# EAGLE design tinyx_core_v0 (EAGLE 9.4.2)
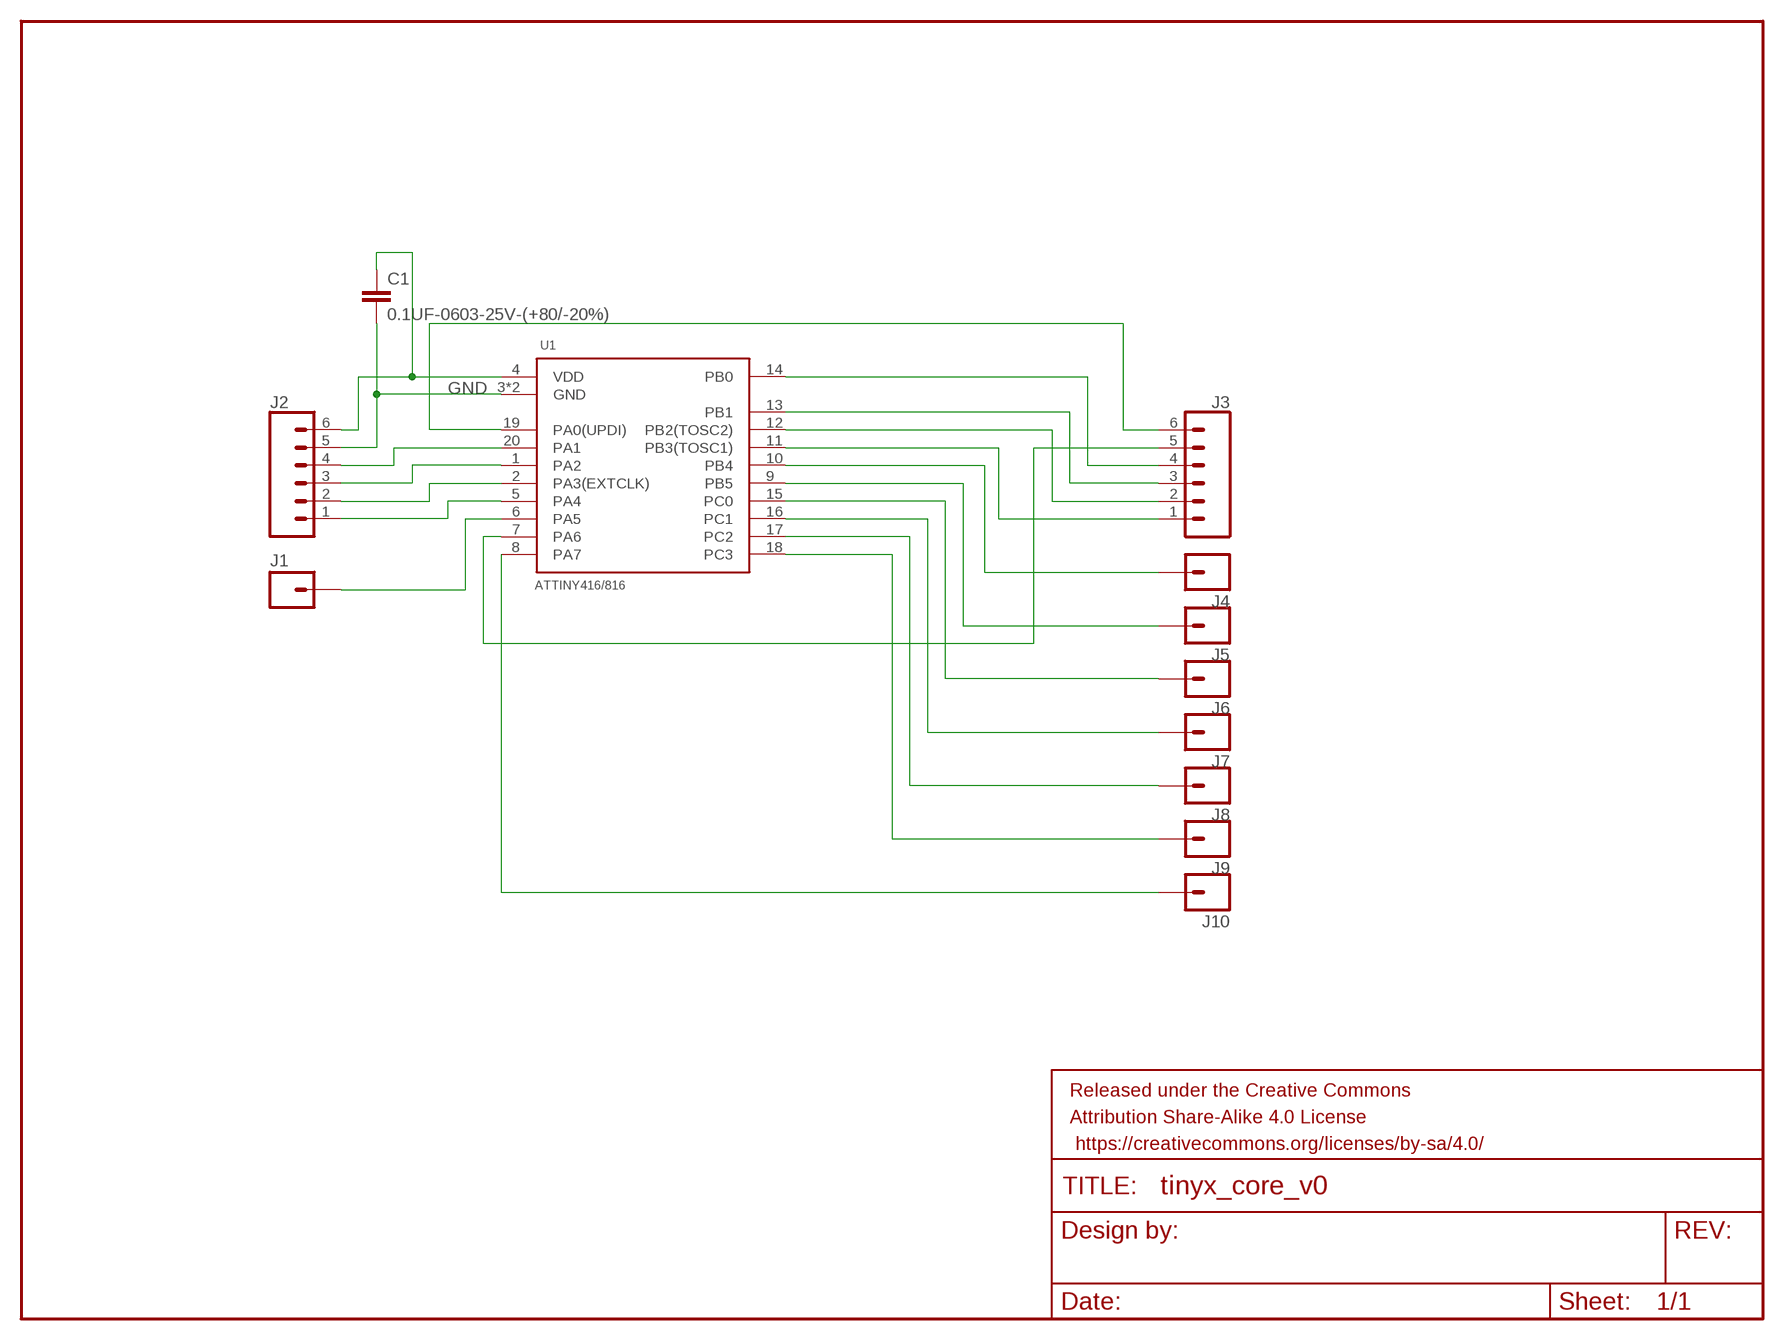
[diagram p0: schematic, sheet 1]

## Parts
C1  0.1UF-0603-25V-(+80/-20%)  [0603]
FRAME1  FRAME-LETTER  [CREATIVE_COMMONS]
J1  M01TINY  [1X01_TINY]
J2  CONN_06NO_SILK_FEMALE_PTH  [1X06_NO_SILK]
J3  CONN_06NO_SILK_FEMALE_PTH  [1X06_NO_SILK]
J4  M01TINY  [1X01_TINY]
J5  M01TINY  [1X01_TINY]
J6  M01TINY  [1X01_TINY]
J7  M01TINY  [1X01_TINY]
J8  M01TINY  [1X01_TINY]
J9  M01TINY  [1X01_TINY]
J10  M01TINY  [1X01_TINY]
U1  ATTINY416/816  [VQFN-20]

## Nets
GND: C1.2 J2.5 U1.3(GND) U1.EXP(GND)
N$1: C1.1 J2.6 U1.4(VDD)
N$3: J2.4 U1.20(PA1)
N$4: J2.3 U1.1(PA2)
N$5: J2.2 U1.2(PA3(EXTCLK))
N$6: J2.1 U1.5(PA4)
N$7: J3.6 U1.19(PA0(UPDI))
N$8: J3.5 U1.7(PA6)
N$9: J3.4 U1.14(PB0)
N$10: J3.3 U1.13(PB1)
N$11: J3.2 U1.12(PB2(TOSC2))
N$12: J3.1 U1.11(PB3(TOSC1))
N$13: J1.P$1 U1.6(PA5)
N$14: J4.P$1 U1.10(PB4)
N$15: J5.P$1 U1.9(PB5)
N$16: J6.P$1 U1.15(PC0)
N$17: J7.P$1 U1.16(PC1)
N$18: J8.P$1 U1.17(PC2)
N$19: J9.P$1 U1.18(PC3)
N$20: J10.P$1 U1.8(PA7)

## Library data of the parts
C1 = SparkFun-Capacitors:0.1UF: 0.1µF ceramic capacitors A capacitor is a passive two-terminal electrical component used to store electrical energy temporarily in an electric field.; PROD_ID: CAP-00810; VALUE: 0.1uF
FRAME1 = SparkFun-Aesthetics:FRAME-LETTER: Schematic Frame - Letter Standard 8.5x11 US Letter frame
J1 J4-J10 = graftel-internal-ic:M01: Header 1 Standard 1-pin 0.1" header. Use with straight break away headers (SKU : PRT-00116), right angle break away headers (PRT-00553), swiss pins (PRT-00743), machine pins (PRT-00117), and female headers (PRT-00115). SMTSO-256-ET is a "flush mount" nut for a 4-40 screw. The older package used to be too tight, and did not allow it to sit properly thru the drill hit. The latest (0.165DIA) fits nice and snug.
J2 J3 = SparkFun-Connectors:CONN_06: Multi connection point. Often used as Generic Header-pin footprint for 0.1 inch spaced/style header connections On any of the 0.1 inch spaced packages, you can populate with these: Break Away Headers - Straight <https://www.sparkfun.com/products/116> (PRT-00116) Break Away Male Headers - Right Angle <https://www.sparkfun.com/products/553> (PRT-00553) Female Headers <https://www.sparkfun.com/products/115> (PRT-00115) Break Away Headers - Machine Pin <https://www.sparkfun.com/products/117> (PRT-00117) Break Away Female Headers - Swiss Machine Pin <https://www.sparkfun.com/products/743> (PRT-00743) Arduino Stackable Header - 6 Pin <https://www.sparkfun.com/products/9280> (PRT-09280) For SCREWTERMINALS and SPRING TERMINALS visit here: Screw Terimnals on SparkFun.com <https://www.sparkfun.com/search/results?term=Screw+Terminals> (5mm/3.5mm/2.54mm spacing) This device is also useful as a general connection point to wire up your design to another part of your project. Our various solder wires solder well into these plated through hole pads. Hook-Up Wire - Assortment (Stranded, 22 AWG) <https://www.sparkfun.com/products/11375> (PRT-11375) Hook-Up Wire - Assortment (Solid Core, 22 AWG) <https://www.sparkfun.com/products/11367> (PRT-11367) View the entire wire category on our website here <https://www.sparkfun.com/categories/141>; PROD_ID: CONN-08437
U1 = graftel-internal-ic:ATTINY416/816

## Board
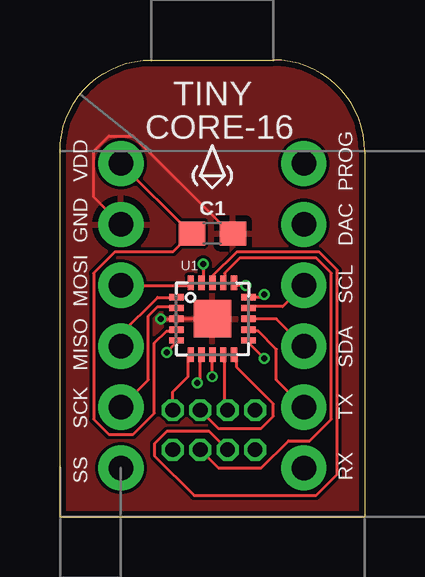
[diagram p1: board, top side]
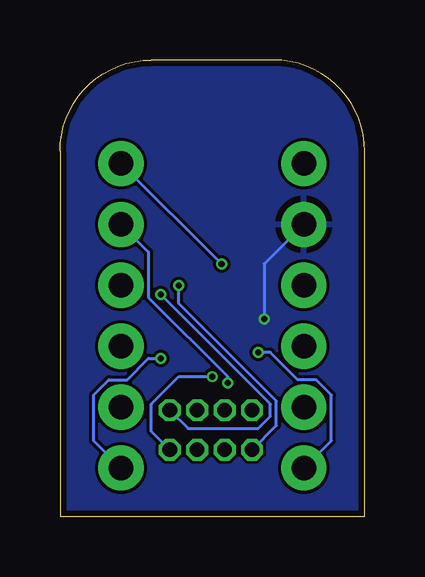
[diagram p2: board, bottom side, seen from below]

Size 12.7 x 19.05 mm. Coordinates in mm from the lower left corner, seen from the top.
Outline: 0,0 12.7,0 12.7,15.24 arc90 8.89,19.05 3.81,19.05 arc90 0,15.24 0,0
Copper layers (1*16): Top 0.035mm / dielectric 1.5mm / Bottom 0.035mm
Design rules "MF_Standard_2_Layer": minimum track width 5mil, minimum drill 10mil, track to track 5mil, track to pad 5mil, pad to pad 5mil, via to via 5mil, smd to smd 0mil, copper to edge 10mil, drill to drill 10mil, minimum pad ring 4mil, minimum via ring 4mil, stop-mask expansion 2mil, vias tented up to drill 25mil, thermal gap 10mil

### Footprints (pad centres in the part's own frame; a part is rotated, then mirrored left to right if it is on the bottom)
0603 = smd 1.1 x 1: 1 -0.85,0; 2 0.85,0
1X01_TINY = drill 0.61 octagon: P$1 0,0
1X06_NO_SILK = drill 1.016 pad 1.88: 1 0,0; 2 2.54,0; 3 5.08,0; 4 7.62,0; 5 10.16,0; 6 12.7,0
VQFN-20 = smd 0.6 x 0.26: 1 -1.5,0.9; 2 -1.5,0.45; 3 -1.5,0; 4 -1.5,-0.45; 5 -1.5,-0.9; 11 1.5,-0.9; 12 1.5,-0.45; 13 1.5,0; 14 1.5,0.45; 15 1.5,0.9 | smd 0.26 x 0.6: 6 -0.9,-1.5; 7 -0.45,-1.5; 8 0,-1.5; 9 0.45,-1.5; 10 0.9,-1.5; 16 0.9,1.5; 17 0.45,1.5; 18 0,1.5; 19 -0.45,1.5; 20 -0.9,1.5 | smd 1.55 x 1.55: EXP 0,0

### Placement (x,y rotation side)
C1  6.35,11.81 0 top
FRAME1  17.78,-16.51 0 top  (outside the outline)
J1  4.7,4.45 0 top
J2  2.54,2.03 90 top
J3  10.16,2.03 90 top
J4  5.84,4.45 0 top
J5  6.99,4.45 0 top
J6  8.13,4.45 0 top
J7  4.7,2.79 0 top
J8  5.84,2.79 0 top
J9  6.99,2.79 0 top
J10  8.13,2.79 90 top
U1  6.35,8.26 0 top

### Tracks (layer width: path | path; a pad name or v marks a point on that pad's centre or on a via)
GND  (via drill 0.25)
  Top 0.127: U1.EXP U1.3 v4.19,8.26 | J2.5 1.4,13.34 1.4,15.24 2.03,15.88 3.05,15.88 7.11,11.81 C1.2
  Bottom 0.127: v4.19,8.26 4.19,10.54 J2.5
  pour Top: 0,0 0,15.24 arc-90 3.81,19.05 8.89,19.05 arc-90 12.7,15.24 12.7,0
  pour Bottom: 0,0 0,15.24 arc-90 3.81,19.05 8.89,19.05 arc-90 12.7,15.24 12.7,0
N$1
  Top 0.127: 5.46,11.81 4.7,11.05 2.29,11.05 1.4,10.16 1.4,4.06 2.03,3.43 3.05,3.43 3.94,4.32 3.94,7.24 4.45,7.75 4.83,7.75 U1.4 | 5.46,11.81 J2.6 | 5.46,11.81 C1.1
N$3
  Top 0.127: J2.4 5.33,9.65 U1.20
N$4
  Top 0.127: J2.3 2.54,7.62 4.06,9.14 4.83,9.14 U1.1
N$5
  Top 0.127: J2.2 3.68,5.71 3.68,8.38 4.06,8.76 4.83,8.76 U1.2
N$6  (via drill 0.25)
  Top 0.127: v4.45,6.86 4.83,7.24 U1.5
  Bottom 0.127: v4.45,6.86 3.94,6.86 2.79,5.71 2.03,5.71 1.4,5.08 1.4,3.17 J2.1
N$7  (via drill 0.25)
  Top 0.127: v5.97,10.54 5.97,9.78 U1.19
  Bottom 0.127: J3.6 v5.97,10.54
N$8  (via drill 0.25)
  Top 0.127: v5.71,5.59 5.84,5.71 5.84,6.73 U1.7
  Bottom 0.127: v5.71,5.59 5.71,5.84 9.02,9.14 9.02,11.05 J3.5
N$9
  Top 0.127: J3.4 9.27,8.76 7.87,8.76 U1.14
N$10
  Top 0.127: U1.13 9.02,8.26 J3.3
N$11
  Top 0.127: J3.2 9.02,5.71 9.02,6.99 8.26,7.75 7.87,7.75 U1.12
N$12  (via drill 0.25)
  Top 0.127: v8.51,6.6 7.87,7.24 U1.11
  Bottom 0.127: v8.51,6.6 9.02,6.6 9.91,5.71 10.67,5.71 11.3,5.08 11.3,3.17 J3.1
N$13
  Top 0.127: J1.P$1 4.7,5.21 5.33,5.84 5.33,6.73 U1.6
N$14
  Top 0.127: J4.P$1 6.6,3.68 8.38,3.68 8.89,4.19 8.89,4.7 7.37,6.22 7.37,6.73 U1.10
N$15
  Top 0.127: J5.P$1 6.86,4.57 6.86,6.73 U1.9
N$16  (via drill 0.25)
  Top 0.127: v8.51,9.27 8.38,9.14 7.87,9.14 U1.15
  Bottom 0.127: v8.51,9.27 3.94,4.7 3.94,4.19 4.45,3.68 7.37,3.68 J6.P$1
N$17  (via drill 0.25)
  Top 0.127: v7.75,9.65 7.37,9.65 U1.16
  Bottom 0.127: v7.75,9.65 7.75,8.89 3.68,4.83 3.68,3.81 J7.P$1
N$18
  Top 0.127: J8.P$1 6.6,2.03 8.38,2.03 9.53,3.17 10.41,3.17 11.3,4.06 11.3,10.16 10.67,10.79 7.49,10.79 6.86,10.16 6.86,9.78 U1.17
N$19
  Top 0.127: U1.18 6.35,10.03 7.37,11.05 10.79,11.05 11.56,10.29 11.56,1.78 10.67,0.89 5.59,0.89 3.94,2.54 3.94,3.05 4.45,3.56 6.22,3.56 J9.P$1
N$20  (via drill 0.25)
  Top 0.127: v6.35,5.84 U1.8
  Bottom 0.127: v6.35,5.84 7.75,5.84 8.89,4.7 8.89,3.56 J10.P$1

### Text on the board
tPlace: TINY | CORE-16 | VDD | PROG | GND | DAC | MOSI | SCL | MISO | SDA | SCK | TX | RX | SS